# EAGLE design Power_Supply (EAGLE 4.16)
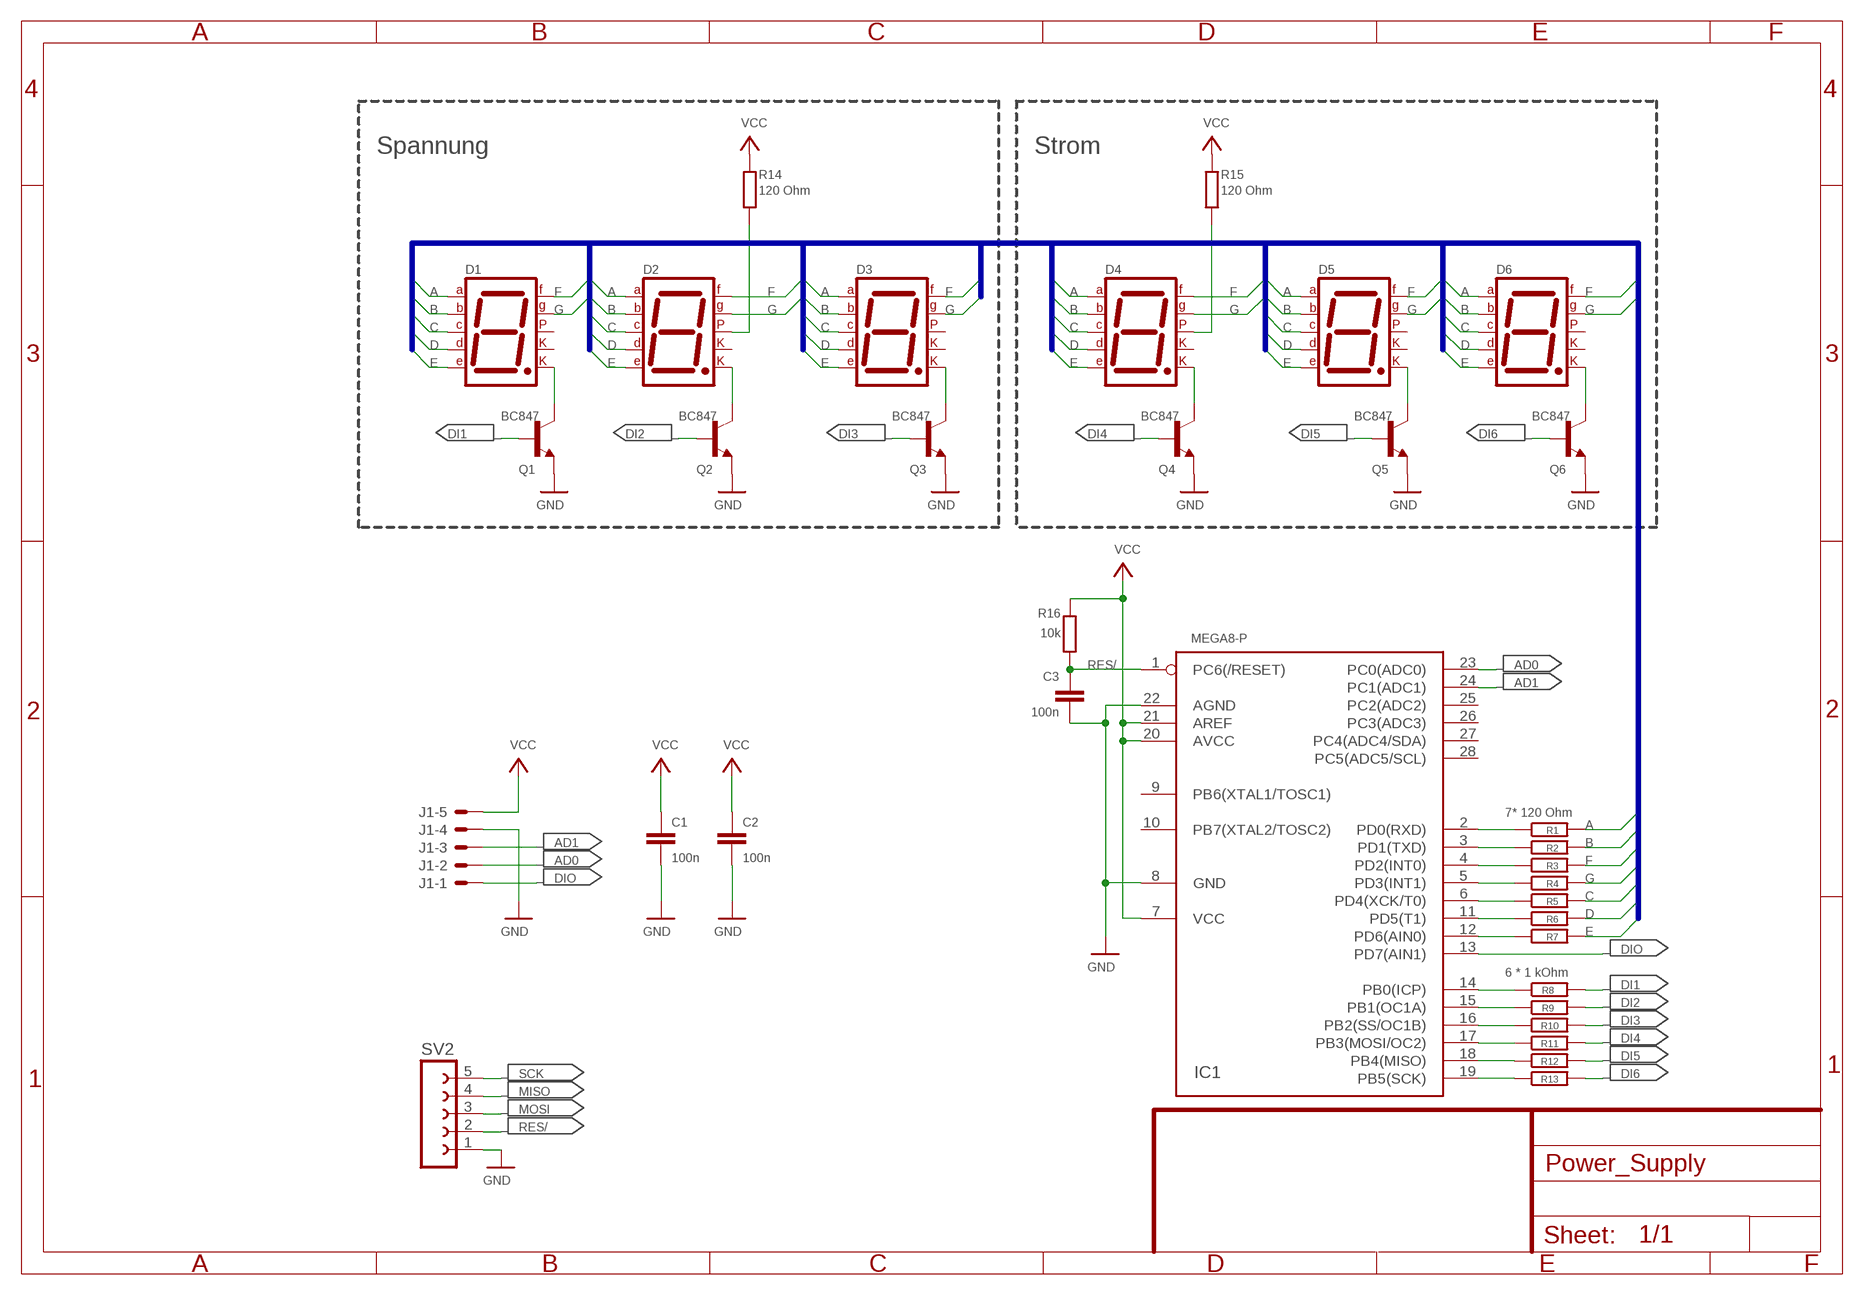
[diagram p0: schematic, sheet 1]

## Parts
C1  100n  C-EU025-025X050  [C025-025X050]
C2  100n  C-EU025-025X050  [C025-025X050]
C3  100n  C-EU025-025X050  [C025-025X050]
D1  7SEG-CK  [7SEG-13]
D2  7SEG-CK  [7SEG-13]
D3  7SEG-CK  [7SEG-13]
D4  7SEG-CK  [7SEG-13]
D5  7SEG-CK  [7SEG-13]
D6  7SEG-CK  [7SEG-13]
IC1  MEGA8-P  [DIL28-3]
J1  22-27-2051-05  [6410-05]
Q1  BC847  BC847BSMD  [SOT23]
Q2  BC847  BC847BSMD  [SOT23]
Q3  BC847  BC847BSMD  [SOT23]
Q4  BC847  BC847BSMD  [SOT23]
Q5  BC847  BC847BSMD  [SOT23]
Q6  BC847  BC847BSMD  [SOT23]
R1  7* 120 Ohm  R-EU_0207/10  [0207/10]
R2  R-EU_0207/10  [0207/10]
R3  R-EU_0207/10  [0207/10]
R4  R-EU_0207/10  [0207/10]
R5  R-EU_0207/10  [0207/10]
R6  R-EU_0207/10  [0207/10]
R7  R-EU_0207/10  [0207/10]
R8  6 * 1 kOhm  R-EU_0207/10  [0207/10]
R9  R-EU_0207/10  [0207/10]
R10  R-EU_0207/10  [0207/10]
R11  R-EU_0207/10  [0207/10]
R12  R-EU_0207/10  [0207/10]
R13  R-EU_0207/10  [0207/10]
R14  120 Ohm  R-EU_0207/10  [0207/10]
R15  120 Ohm  R-EU_0207/10  [0207/10]
R16  10k  R-EU_0207/10  [0207/10]
SV2  FE05-1  [FE05-1]

## Nets
A: D1.7(A) D2.7(A) D3.7(A) D4.7(A) D5.7(A) D6.7(A) R1.2
AD0: IC1.23(PC0(ADC0)) J1.2
AD1: IC1.24(PC1(ADC1)) J1.3
B: D1.6(B) D2.6(B) D3.6(B) D4.6(B) D5.6(B) D6.6(B) R2.2
C: D1.4(C) D2.4(C) D3.4(C) D4.4(C) D5.4(C) D6.4(C) R5.2
D: D1.2(D) D2.2(D) D3.2(D) D4.2(D) D5.2(D) D6.2(D) R6.2
DI1: Q1.1(B) R8.2
DI2: Q2.1(B) R9.2
DI3: Q3.1(B) R10.2
DI4: Q4.1(B) R11.2
DI5: Q5.1(B) R12.2
DI6: Q6.1(B) R13.2
DIO: IC1.13(PD7(AIN1)) J1.1
E: D1.1(E) D2.1(E) D3.1(E) D4.1(E) D5.1(E) D6.1(E) R7.2
F: D1.9(F) D2.9(F) D3.9(F) D4.9(F) D5.9(F) D6.9(F) R3.2
G: D1.10(G) D2.10(G) D3.10(G) D4.10(G) D5.10(G) D6.10(G) R4.2
GND: C1.2 C2.2 C3.2 IC1.8(GND) IC1.22(AGND) J1.4 Q1.2(E) Q2.2(E) Q3.2(E) Q4.2(E) Q5.2(E) Q6.2(E) SV2.1
MISO: IC1.18(PB4(MISO)) R12.1 SV2.4
MOSI: IC1.17(PB3(MOSI/OC2)) R11.1 SV2.3
N$1: IC1.2(PD0(RXD)) R1.1
N$2: IC1.3(PD1(TXD)) R2.1
N$3: IC1.4(PD2(INT0)) R3.1
N$4: IC1.5(PD3(INT1)) R4.1
N$5: IC1.6(PD4(XCK/T0)) R5.1
N$6: IC1.11(PD5(T1)) R6.1
N$7: IC1.12(PD6(AIN0)) R7.1
N$8: D1.8(CK2) Q1.3(C)
N$9: D2.8(CK2) Q2.3(C)
N$10: D3.8(CK2) Q3.3(C)
N$11: D4.8(CK2) Q4.3(C)
N$12: D5.8(CK2) Q5.3(C)
N$13: D6.8(CK2) Q6.3(C)
N$14: IC1.14(PB0(ICP)) R8.1
N$15: IC1.15(PB1(OC1A)) R9.1
N$16: IC1.16(PB2(SS/OC1B)) R10.1
N$20: D2.5(DP) R14.1
N$21: D4.5(DP) R15.1
RES/: C3.1 IC1.1(PC6(/RESET)) R16.1 SV2.2
SCK: IC1.19(PB5(SCK)) R13.1 SV2.5
VCC: C1.1 C2.1 IC1.7(VCC) IC1.20(AVCC) IC1.21(AREF) J1.5 R14.2 R15.2 R16.2
Unconnected: D1.3(CK1) D1.5(DP) D2.3(CK1) D3.3(CK1) D3.5(DP) D4.3(CK1) D5.3(CK1) D5.5(DP) D6.3(CK1) D6.5(DP) IC1.9(PB6(XTAL1/TOSC1)) IC1.10(PB7(XTAL2/TOSC2)) IC1.25(PC2(ADC2)) IC1.26(PC3(ADC3)) IC1.27(PC4(ADC4/SDA)) IC1.28(PC5(ADC5/SCL))

## Buses
A,B,C,D,E,F,G

## Notes on the sheet
- Spannung | Strom

## Library data of the parts
C1-C3 = rcl:C-EU: CAPACITOR, European symbol
D1-D6 = special:7SEG-CK: 7-segment DISPLAY single cathode, 13 mm
IC1 = avr-1:MEGA8-P: MICROCONTROLLER 8 Kbytes FLASH 1 kbytes SRAM 512 bytes EEPROM USART 4-channel 10 bit ADC 2-channel 8 bit ADC
J1 = con-molex:22-?-05: CONNECTOR wire to board 2.54 mm (.1 inch) pitch header
Q1-Q6 = transistor-npn:BC847*: NPN Transistor
R1-R16 = rcl:R-EU_: RESISTOR, European symbol
SV2 = con-lsta:FE05-1: FEMALE HEADER

## Board
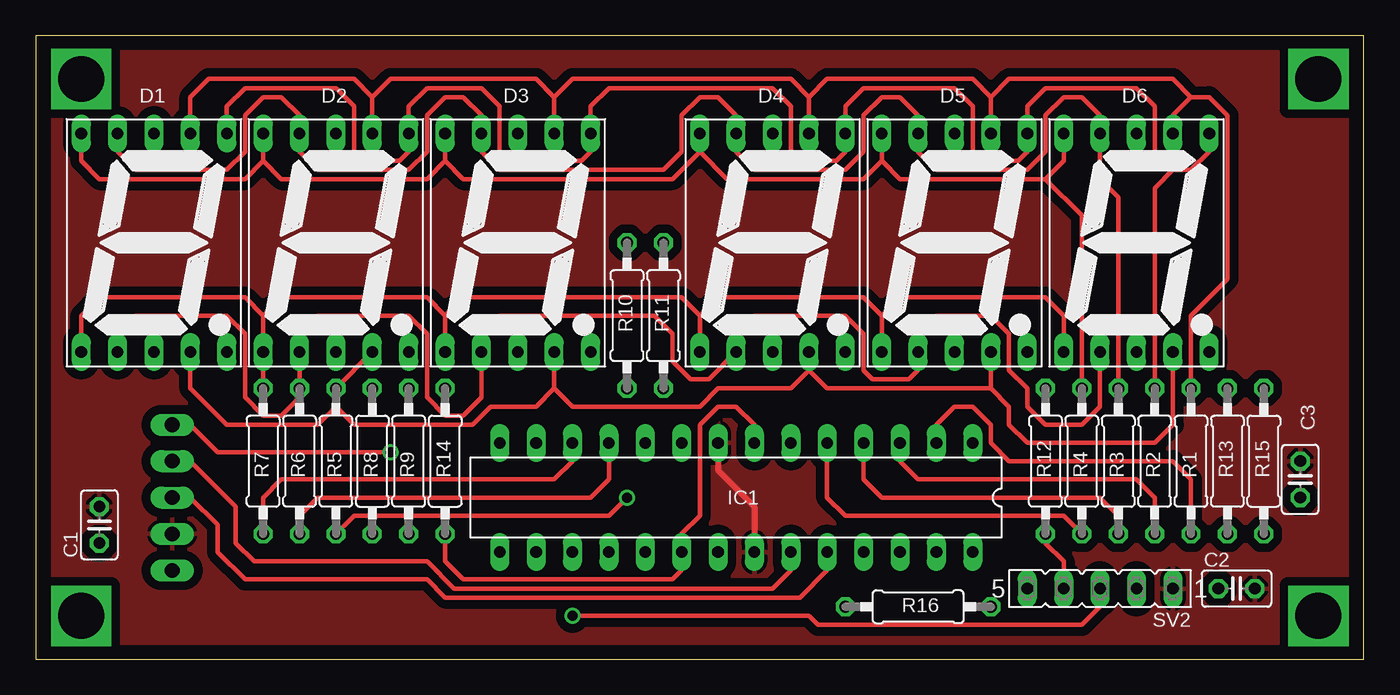
[diagram p1: board, top side]
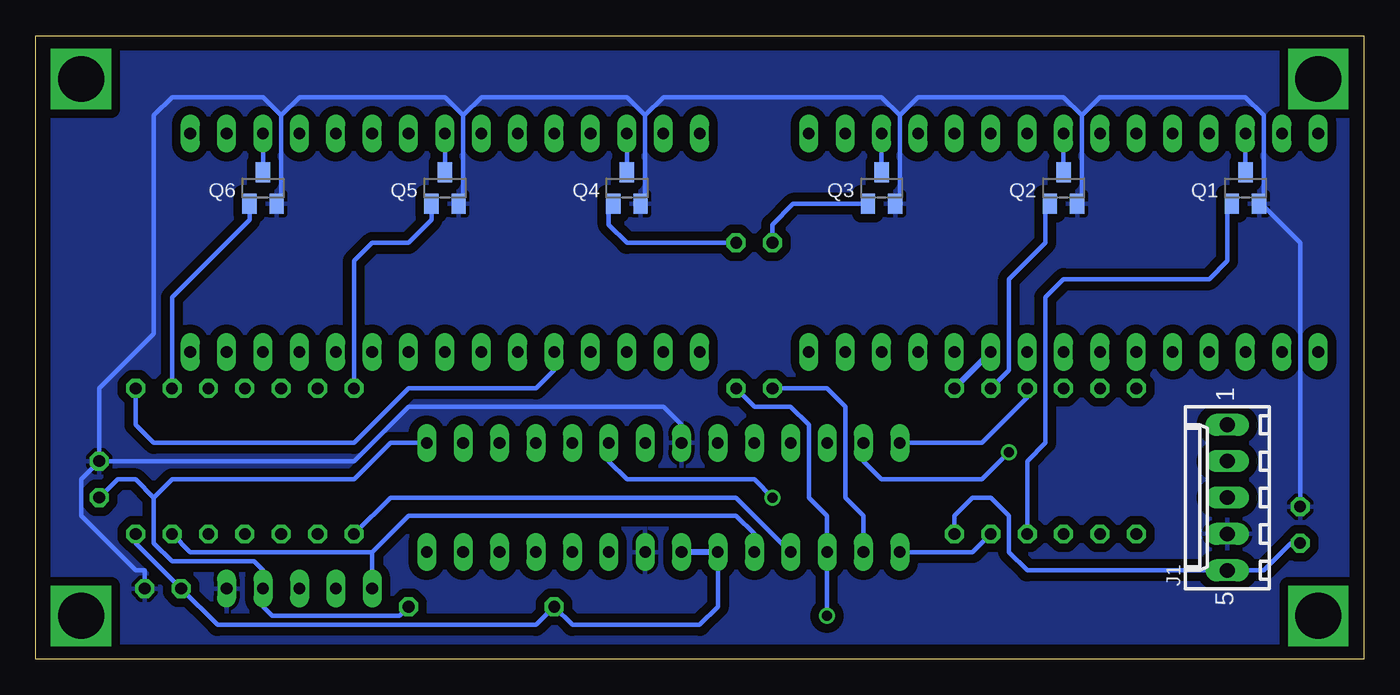
[diagram p2: board, bottom side, seen from below]

Size 92.69 x 43.48 mm. Coordinates in mm from the lower left corner, seen from the top.
Outline: 0,0 92.69,0 92.69,43.48 0,43.48 0,0
Copper layers (1*16): Top 0.035mm / dielectric 1.5mm / Bottom 0.035mm
Design rules "default": minimum track width 10mil, minimum drill 24mil, track to track 8mil, track to pad 8mil, pad to pad 8mil, via to via 8mil, smd to smd 8mil, copper to edge 40mil, drill to drill 8mil, minimum pad ring 10mil, minimum via ring 8mil, stop-mask expansion 4mil, vias tented up to drill 0mil, thermal gap 10mil

### Footprints (pad centres in the part's own frame; a part is rotated, then mirrored left to right if it is on the bottom)
C025-025X050 = drill 0.813 octagon: 1 -1.27,0; 2 1.27,0
7SEG-13 = drill 0.813 long: 1 -5.08,-7.62; 2 -2.54,-7.62; 3 0,-7.62; 4 2.54,-7.62; 5 5.08,-7.62; 6 5.08,7.62; 7 2.54,7.62; 8 0,7.62; 9 -2.54,7.62; 10 -5.08,7.62
DIL28-3 = drill 0.813 long: 1 -16.51,-3.81; 2 -13.97,-3.81; 3 -11.43,-3.81; 4 -8.89,-3.81; 5 -6.35,-3.81; 6 -3.81,-3.81; 7 -1.27,-3.81; 8 1.27,-3.81; 9 3.81,-3.81; 10 6.35,-3.81; 11 8.89,-3.81; 12 11.43,-3.81; 13 13.97,-3.81; 14 16.51,-3.81; 15 16.51,3.81; 16 13.97,3.81; 17 11.43,3.81; 18 8.89,3.81; 19 6.35,3.81; 20 3.81,3.81; 21 1.27,3.81; 22 -1.27,3.81; 23 -3.81,3.81; 24 -6.35,3.81; 25 -8.89,3.81; 26 -11.43,3.81; 27 -13.97,3.81; 28 -16.51,3.81
6410-05 = drill 1.016 long: 1 5.08,0; 2 2.54,0; 3 0,0; 4 -2.54,0; 5 -5.08,0
SOT23 = smd 1 x 1.4: 1 -0.95,-1.1; 2 0.95,-1.1; 3 0,1.1
0207/10 = drill 0.813 octagon: 1 -5.08,0; 2 5.08,0
FE05-1 = drill 0.813 long: 1 -5.08,0; 2 -2.54,0; 3 0,0; 4 2.54,0; 5 5.08,0

### Placement (x,y rotation side)
C1  4.44,9.36 90 top
C2  83.81,4.92 0 top
C3  88.26,12.54 90 top
D1  8.25,29.05 0 top
D2  20.95,29.05 0 top
D3  33.65,29.05 0 top
D4  51.43,29.05 0 top
D5  64.13,29.05 0 top
D6  76.83,29.05 0 top
IC1  48.89,11.27 180 top
J1  9.52,11.27 90 bottom
Q1  8.25,32.86 0 bottom
Q2  20.95,32.86 0 bottom
Q3  33.65,32.86 0 bottom
Q4  51.43,32.86 0 bottom
Q5  64.13,32.86 0 bottom
Q6  76.83,32.86 0 bottom
R1  80.64,13.81 90 top
R2  78.1,13.81 90 top
R3  75.56,13.81 90 top
R4  73.02,13.81 90 top
R5  20.95,13.81 90 top
R6  18.41,13.81 90 top
R7  15.87,13.81 90 top
R8  23.49,13.81 270 top
R9  26.03,13.81 90 top
R10  41.27,23.96 90 top
R11  43.81,23.96 90 top
R12  70.48,13.81 90 top
R13  83.18,13.81 90 top
R14  28.57,13.81 270 top
R15  85.72,13.81 270 top
R16  61.59,3.65 180 top
SV2  74.29,4.92 180 top

### Tracks (layer width: path | path; a pad name or v marks a point on that pad's centre or on a via)
A
  Top 0.305: D1.7 10.79,39.2 12.06,40.48 22.22,40.48 23.49,39.2 | 23.49,39.2 D2.7 | 23.49,39.2 24.76,40.48 34.92,40.48 36.19,39.2 | 36.19,39.2 D3.7 | 36.19,39.2 37.46,40.48 52.7,40.48 53.97,39.2 | 53.97,39.2 D4.7 | 53.97,39.2 55.24,40.48 65.4,40.48 66.67,39.2 | 66.67,39.2 D5.7 | 66.67,39.2 67.94,40.48 79.37,40.48 80.64,39.2 | R1.2 80.64,23.96 83.18,26.51 83.18,37.94 81.91,39.2 80.64,39.2 | D6.7 79.37,37.94 80.64,39.2
AD0
  Top 0.305: IC1.23 52.7,6.18 51.43,4.92 29.2,4.92 27.3,6.82 15.23,6.82 13.96,8.09 13.96,10.63 10.79,13.81 J1.2
AD1
  Top 0.305: IC1.24 55.24,6.18 53.34,4.28 28.57,4.28 27.3,5.55 14.6,5.55 12.7,7.46 12.7,9.36 10.79,11.27 J1.3
B
  Top 0.305: D1.6 13.33,38.57 14.6,39.84 20.95,39.84 22.22,38.57 22.22,35.4 22.86,34.76 25.39,34.76 26.03,35.4 D2.6 26.03,38.57 27.3,39.84 31.11,39.84 32.38,38.57 32.38,35.4 33.02,34.76 38.09,34.76 38.73,35.4 D3.6 38.73,38.57 40,39.84 51.43,39.84 52.7,38.57 52.7,35.4 53.34,34.76 55.88,34.76 56.51,35.4 D4.6 56.51,38.57 57.78,39.84 64.13,39.84 65.4,38.57 65.4,35.4 66.03,34.76 68.58,34.76 69.21,35.4 D5.6 69.21,38.57 70.48,39.84 76.83,39.84 78.1,38.57 78.1,35.4 79.37,34.12 | 79.37,34.12 80.64,34.12 81.91,35.4 D6.6 | 79.37,34.12 78.1,32.86 R2.2
C
  Top 0.305: D1.4 10.79,18.89 13.33,16.35 19.68,16.35 20.95,17.62 | 36.19,18.89 D3.4 | 36.19,18.89 37.46,17.62 46.35,17.62 47.62,18.89 52.7,18.89 53.97,20.16 | 53.97,20.16 D4.4 | 53.97,20.16 55.24,18.89 66.67,18.89 | 66.67,18.89 D5.4 | 66.67,18.89 67.94,17.62 67.94,16.35 69.21,15.08 78.1,15.08 79.37,16.35 D6.4 | 36.19,18.89 34.92,17.62 31.74,17.62 30.47,16.35 22.22,16.35 20.95,17.62 | D2.4 R5.2 20.95,17.62
D
  Top 0.305: D1.2 5.71,22.7 6.98,23.96 13.33,23.96 14.6,22.7 14.6,18.25 15.87,16.98 17.14,16.98 18.41,18.25 R6.2 D2.2 18.41,22.7 19.68,23.96 26.03,23.96 27.3,22.7 27.3,18.25 28.57,16.98 29.84,16.98 31.11,18.25 D3.2 31.11,22.7 32.38,23.96 43.17,23.96 44.45,22.7 44.45,20.79 45.71,19.52 46.98,19.52 D4.2 48.89,22.7 50.16,23.96 56.51,23.96 57.78,22.7 57.78,20.16 58.41,19.52 60.95,19.52 61.59,20.16 D5.2 61.59,22.7 62.86,23.96 66.67,23.96 67.94,22.7 67.94,20.16 69.21,18.89 69.21,17.62 70.48,16.35 73.02,16.35 74.29,17.62 D6.2
DI1
  Bottom 0.305: R8.2 23.49,13.81 22.22,15.08 22.22,25.23 20.95,26.51 10.79,26.51 9.52,27.78 9.52,31.59 9.35,31.76 Q1.1
DI2
  Bottom 0.305: R9.2 24.76,20.16 24.76,26.51 22.22,29.05 22.22,31.59 22.05,31.76 Q2.1
DI3
  Bottom 0.305: Q3.1 39.83,31.76 41.27,30.32 R10.2
DI4
  Bottom 0.305: Q4.1 52.53,31.76 52.7,31.59 52.7,30.32 51.43,29.05 R11.2
DI5
  Bottom 0.305: Q5.1 65.08,30.64 66.67,29.05 69.21,29.05 70.48,27.78 R12.2
DI6
  Bottom 0.305: Q6.1 77.78,30.64 83.18,25.23 R13.2
DIO  (via drill 0.7)
  Top 0.305: v24.76,14.44 12.7,14.44 10.79,16.35 J1.1
  Bottom 0.305: IC1.13 34.92,13.81 33.65,12.54 26.66,12.54 v24.76,14.44
E
  Top 0.305: D1.1 3.17,23.96 4.44,25.23 14.6,25.23 15.87,23.96 | 28.57,23.96 D3.1 | 28.57,23.96 29.84,25.23 45.08,25.23 46.35,23.96 | 59.05,23.96 D5.1 | 59.05,23.96 60.32,25.23 70.48,25.23 71.75,23.96 D6.1 | 15.87,23.96 D2.1 R7.2 | 15.87,23.96 17.14,25.23 27.3,25.23 28.57,23.96 | 46.35,23.96 D4.1 | 46.35,23.96 47.62,25.23 57.78,25.23 59.05,23.96
F
  Top 0.305: D1.9 5.71,35.4 6.98,34.12 13.33,34.12 14.6,35.4 14.6,37.94 15.87,39.2 17.14,39.2 18.41,37.94 D2.9 18.41,35.4 19.68,34.12 26.03,34.12 27.3,35.4 27.3,37.94 28.57,39.2 29.84,39.2 31.11,37.94 D3.9 31.11,35.4 32.38,34.12 43.81,34.12 45.08,35.4 45.08,37.94 46.35,39.2 47.62,39.2 48.89,37.94 D4.9 48.89,35.4 50.16,34.12 56.51,34.12 57.78,35.4 57.78,37.94 59.05,39.2 60.32,39.2 61.59,37.94 D5.9 61.59,35.4 62.86,34.12 69.21,34.12 70.48,35.4 70.48,37.94 71.75,39.2 73.02,39.2 74.29,37.94 D6.9 74.29,33.49 75.56,32.22 R3.2
G
  Top 0.305: D1.10 3.17,34.76 4.44,33.49 14.6,33.49 15.87,34.76 | 15.87,34.76 D2.10 | 15.87,34.76 17.14,33.49 27.3,33.49 28.57,34.76 | 28.57,34.76 D3.10 | 28.57,34.76 29.84,33.49 44.45,33.49 46.35,35.4 | 46.35,35.4 D4.10 | 46.35,35.4 48.26,33.49 57.78,33.49 59.05,34.76 | 59.05,34.76 D5.10 | 59.05,34.76 60.32,33.49 70.48,33.49 | D6.10 71.75,34.76 70.48,33.49 | 70.48,33.49 73.02,30.95 R4.2
GND
  Top 0.406: IC1.8 47.62,13.17 50.16,10.63 IC1.22
  Bottom 0.305: 6.98,31.59 6.98,37.94 8.25,39.2 18.41,39.2 19.68,37.94 | Q2.2 19.85,31.76 19.68,31.59 19.68,37.94 | Q3.2 32.55,31.76 32.38,31.59 32.38,37.94 | 32.38,37.94 31.11,39.2 20.95,39.2 19.68,37.94 | Q4.2 50.33,31.76 50.16,31.59 50.16,37.94 | 50.16,37.94 48.89,39.2 33.65,39.2 32.38,37.94 | 62.86,37.94 61.59,39.2 51.43,39.2 50.16,37.94 | Q6.2 75.73,31.76 75.56,31.59 75.56,37.94 | 75.56,37.94 74.29,39.2 64.13,39.2 62.86,37.94 | Q5.2 63.03,31.76 62.86,31.59 62.86,37.94 | IC1.8 47.62,16.35 48.89,17.62 66.67,17.62 70.48,13.81 C3.2 | C3.2 88.26,18.89 84.45,22.7 84.45,37.94 83.18,39.2 76.83,39.2 75.56,37.94 | 6.98,31.59 7.15,31.76 Q1.2 | 6.98,31.59 4.44,29.05 C1.2 | C2.2 85.08,6.18 85.72,6.18 89.53,10 89.53,12.54 C3.2
  pour Bottom (isolate 0.61): 0.63,43.02 92.07,43.02 92.07,0.47 0.63,0.47
  pour Top (isolate 0.61): 0.63,43.02 0.63,0.47 92.07,0.47 92.07,43.02
MISO
  Top 0.305: R12.1 70.48,8.09 71.75,6.82 SV2.4
  Bottom 0.305: IC1.18 43.81,11.27 67.94,11.27 R12.1
MOSI  (via drill 0.7)
  Top 0.305: SV2.3 74.29,3.65 73.02,2.38 54.6,2.38 53.97,3.01 v37.46,3.01
  Bottom 0.305: R11.1 42.54,17.62 40,17.62 38.73,16.35 38.73,11.27 37.46,10 IC1.17 v37.46,3.01
N$1
  Top 0.305: IC1.2 62.86,16.35 64.13,17.62 65.4,17.62 66.67,16.35 66.67,15.08 67.94,13.81 79.37,13.81 80.64,12.54 R1.1
N$2
  Top 0.305: R2.1 78.1,11.27 76.83,12.54 61.59,12.54 60.32,13.81 IC1.3
N$3
  Top 0.305: IC1.4 57.78,12.54 59.05,11.27 74.29,11.27 75.56,10 R3.1
N$4
  Top 0.305: IC1.5 55.24,11.27 56.51,10 71.75,10 R4.1
N$5  (via drill 0.7)
  Top 0.305: R5.1 22.22,10 40,10 v41.27,11.27
  Bottom 0.305: v41.27,11.27 42.54,12.54 51.43,12.54 52.7,13.81 IC1.6
N$6
  Top 0.305: R6.1 18.41,10 19.68,11.27 38.73,11.27 40,12.54 IC1.11
N$7
  Top 0.305: R7.1 15.87,11.27 17.14,12.54 36.19,12.54 37.46,13.81 IC1.12
N$8
  Bottom 0.305: Q1.3 D1.8
N$9
  Bottom 0.305: Q2.3 D2.8
N$10
  Bottom 0.305: Q3.3 D3.8
N$11
  Bottom 0.305: Q4.3 D4.8
N$12
  Bottom 0.305: Q5.3 D5.8
N$13
  Bottom 0.305: Q6.3 D6.8
N$14
  Bottom 0.305: IC1.14 26.66,15.08 23.49,18.25 R8.1
N$15
  Bottom 0.305: IC1.15 27.3,7.46 R9.1
N$16
  Bottom 0.305: IC1.16 34.92,10 36.19,11.27 36.19,17.62 37.46,18.89 R10.1
N$20
  Bottom 0.406: R14.1 D2.5
N$21
  Bottom 0.305: D4.5 56.51,20.16 57.78,18.89 66.67,18.89 70.48,15.08 84.45,15.08 85.72,16.35 R15.1
N$22  (via drill 3.2 pad 3.81)
  other vias: 3.17,40.48
N$23  (via drill 3.2 pad 3.81)
  other vias: 3.17,3.01
N$24  (via drill 3.2 pad 3.81)
  other vias: 89.53,3.01
N$25  (via drill 3.2 pad 3.81)
  other vias: 89.53,40.48
RES/
  Bottom 0.305: IC1.1 67.94,15.08 70.48,12.54 83.18,12.54 84.45,11.27 | 84.45,11.27 84.45,8.09 83.18,6.82 77.47,6.82 76.83,6.18 SV2.2 76.83,3.65 76.19,3.01 67.3,3.01 R16.1 | 84.45,11.27 85.72,12.54 86.99,12.54 C3.1
SCK
  Bottom 0.305: IC1.19 42.54,8.73 43.81,10 66.67,10 69.21,7.46 | 69.21,7.46 81.91,7.46 R13.1 | 69.21,7.46 SV2.5
VCC
  Top 0.305: IC1.7 50.16,16.35 48.89,17.62 47.62,17.62 46.35,16.35 46.35,10 45.08,8.73 IC1.20 45.08,6.18 44.45,5.55 29.84,5.55 28.57,6.82 R14.2
  Bottom 0.305: R14.2 28.57,10 27.3,11.27 26.03,11.27 24.76,10 24.76,7.46 23.49,6.18 J1.5 6.98,6.18 5.08,8.09 C1.1 | R15.2 85.72,8.09 C2.1 80,2.38 57.78,2.38 R16.2 55.24,2.38 46.35,2.38 45.08,3.65 IC1.20
  Bottom 0.406: IC1.20 IC1.21